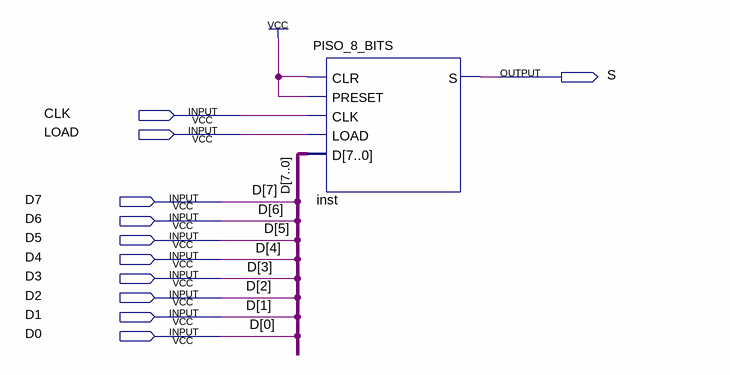
[diagram p0: schematic sheet]
// Quartus schematic tmp.bdf as structural Verilog: 1 symbols, 11 pins
module tmp (
  input  CLK,
  input  LOAD,
  input  D7,
  input  D6,
  input  D5,
  input  D4,
  input  D3,
  input  D2,
  input  D1,
  input  D0,
  output S
);

  PISO_8_BITS inst (.CLR(1'b1), .PRESET(1'b1), .CLK(CLK), .LOAD(LOAD), .D({D7, D6, D5, D4, D3, D2, D1, D0}), .S(S));
endmodule
